# EAGLE design PS2Encoder (generic) (EAGLE 5.03)
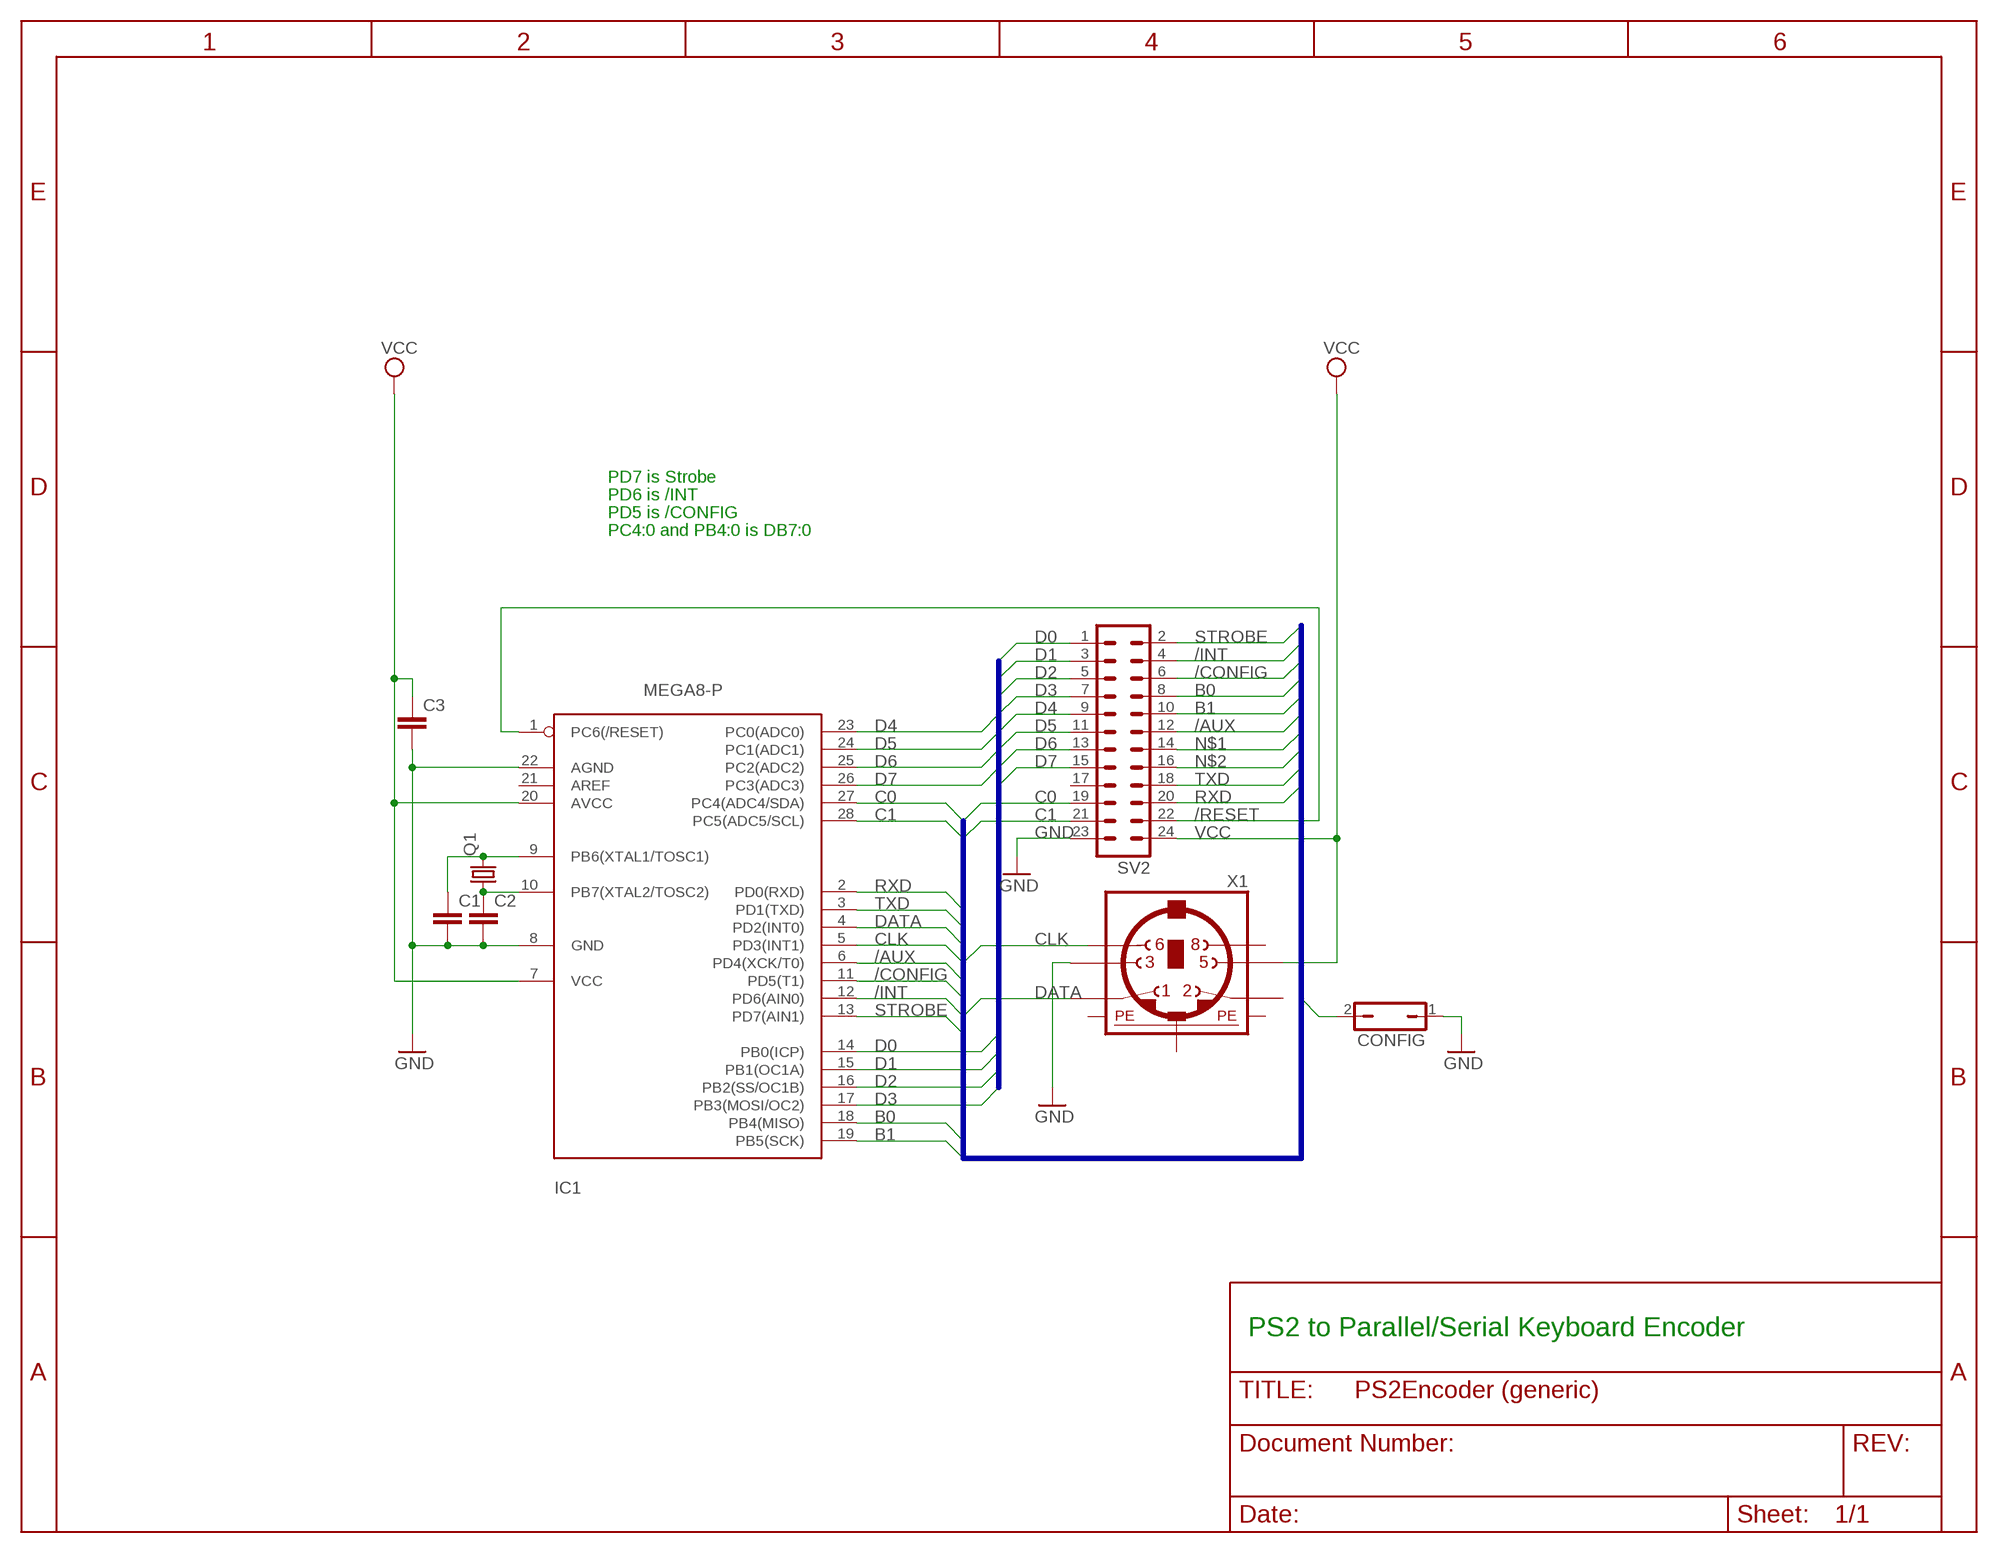
[diagram p0: schematic, sheet 1]

## Parts
C1  C-EU025-024X044  [C025-024X044]
C2  C-EU025-024X044  [C025-024X044]
C3  C-EU025-024X044  [C025-024X044]
CONFIG  JP1Q  [JP1]
IC1  MEGA8-P  [DIL28-3]
Q1  CRYSTALHC49U-V  [HC49U-V]
SV2  MA12-2  [MA12-2]
X1  MINI_DIN_6  [M_DIN6]

## Nets
/AUX: IC1.6(PD4(XCK/T0)) SV2.12
/CONFIG: CONFIG.2 IC1.11(PD5(T1)) SV2.6
/INT: IC1.12(PD6(AIN0)) SV2.4
/RESET: IC1.1(PC6(/RESET)) SV2.22
B0: IC1.18(PB4(MISO)) SV2.8
B1: IC1.19(PB5(SCK)) SV2.10
C0: IC1.27(PC4(ADC4/SDA)) SV2.19
C1: IC1.28(PC5(ADC5/SCL)) SV2.21
CLK: IC1.5(PD3(INT1)) X1.6
D0: IC1.14(PB0(ICP)) SV2.1
D1: IC1.15(PB1(OC1A)) SV2.3
D2: IC1.16(PB2(SS/OC1B)) SV2.5
D3: IC1.17(PB3(MOSI/OC2)) SV2.7
D4: IC1.23(PC0(ADC0)) SV2.9
D5: IC1.24(PC1(ADC1)) SV2.11
D6: IC1.25(PC2(ADC2)) SV2.13
D7: IC1.26(PC3(ADC3)) SV2.15
DATA: IC1.4(PD2(INT0)) X1.1
GND: C1.2 C2.2 C3.2 CONFIG.1 IC1.8(GND) IC1.22(AGND) SV2.23 X1.3
N$1: SV2.14
N$2: SV2.16
N$4: C2.1 IC1.10(PB7(XTAL2/TOSC2)) Q1.1
N$5: C1.1 IC1.9(PB6(XTAL1/TOSC1)) Q1.2
RXD: IC1.2(PD0(RXD)) SV2.20
STROBE: IC1.13(PD7(AIN1)) SV2.2
TXD: IC1.3(PD1(TXD)) SV2.18
VCC: C3.1 IC1.7(VCC) IC1.20(AVCC) SV2.24 X1.5
Unconnected: IC1.21(AREF) SV2.17 X1.2 X1.8

## Buses
D[0..7]
RXD,TXD,/CONFIG,STROBE,/INT,B0,B1,C0,C1,CLK,DATA,/AUX

## Notes on the sheet
- PD7 is Strobe
- PD6 is /INT
- PD5 is /CONFIG
- PC4:0 and PB4:0 is DB7:0
- PS2 to Parallel/Serial Keyboard Encoder

## Power pins joined to a net without a drawn wire
PE1: X1.SH1(PE1)
PE2: X1.SH2(PE2)
PE3: X1.SH3(PE3)

## Library data of the parts
C1-C3 = rcl:C-EU: CAPACITOR, European symbol
CONFIG = jumper:JP1Q: JUMPER
IC1 = atmel:MEGA8-P: MICROCONTROLLER 8 Kbytes FLASH 1 kbytes SRAM 512 bytes EEPROM USART 4-channel 10 bit ADC 2-channel 8 bit ADC Source: avr.lbr
Q1 = crystal:CRYSTAL: CRYSTAL
SV2 = con-lstb:MA12-2: PIN HEADER
X1 = mini_din:MINI_DIN_6

## Board
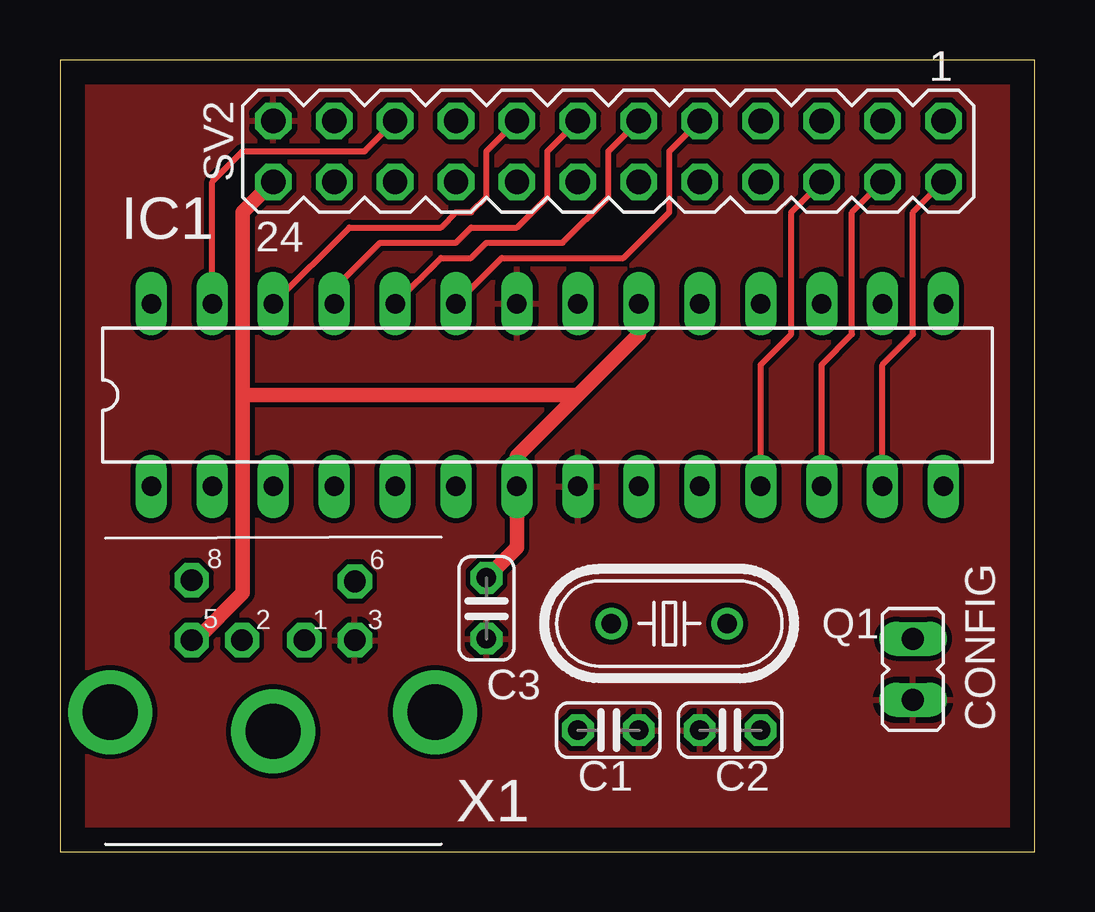
[diagram p1: board, top side]
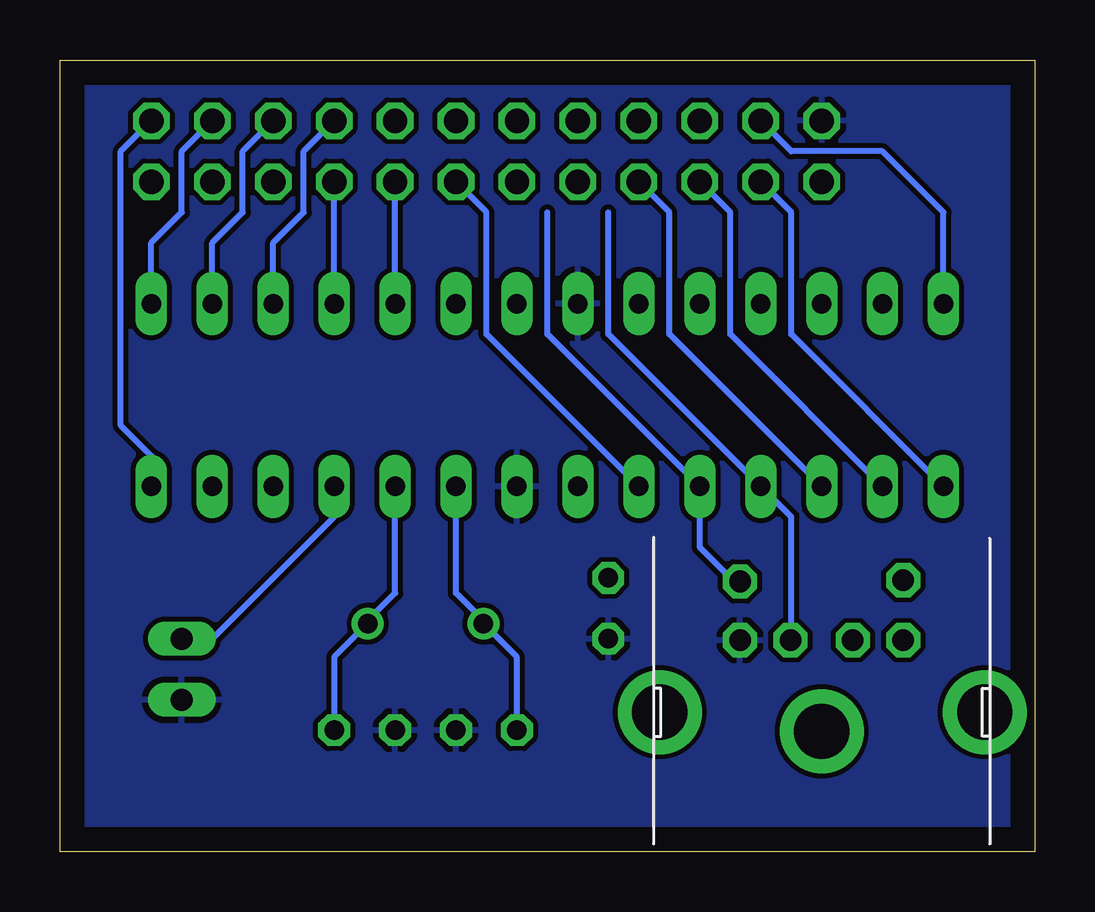
[diagram p2: board, bottom side, seen from below]

Size 40.64 x 33.02 mm. Coordinates in mm from the lower left corner, seen from the top.
Outline: 40.64,0 40.64,33.02 0,33.02 0,0 40.64,0
Copper layers (1*16): Top 0.035mm / dielectric 1.5mm / Bottom 0.035mm
Design rules "default": minimum track width 10mil, minimum drill 24mil, track to track 8mil, track to pad 8mil, pad to pad 8mil, via to via 8mil, smd to smd 8mil, copper to edge 40mil, drill to drill 8mil, minimum pad ring 10mil, minimum via ring 8mil, stop-mask expansion 4mil, vias tented up to drill 0mil, thermal gap 10mil

### Footprints (pad centres in the part's own frame; a part is rotated, then mirrored left to right if it is on the bottom)
C025-024X044 = drill 0.813 octagon: 1 -1.27,0; 2 1.27,0
JP1 = drill 0.914 long: 1 0,-1.27; 2 0,1.27
DIL28-3 = drill 0.813 long: 1 -16.51,-3.81; 2 -13.97,-3.81; 3 -11.43,-3.81; 4 -8.89,-3.81; 5 -6.35,-3.81; 6 -3.81,-3.81; 7 -1.27,-3.81; 8 1.27,-3.81; 9 3.81,-3.81; 10 6.35,-3.81; 11 8.89,-3.81; 12 11.43,-3.81; 13 13.97,-3.81; 14 16.51,-3.81; 15 16.51,3.81; 16 13.97,3.81; 17 11.43,3.81; 18 8.89,3.81; 19 6.35,3.81; 20 3.81,3.81; 21 1.27,3.81; 22 -1.27,3.81; 23 -3.81,3.81; 24 -6.35,3.81; 25 -8.89,3.81; 26 -11.43,3.81; 27 -13.97,3.81; 28 -16.51,3.81
HC49U-V = drill 0.813 round: 1 -2.413,0; 2 2.413,0
MA12-2 = drill 1.016 octagon: 1 -13.97,-1.27; 2 -13.97,1.27; 3 -11.43,-1.27; 4 -11.43,1.27; 5 -8.89,-1.27; 6 -8.89,1.27; 7 -6.35,-1.27; 8 -6.35,1.27; 9 -3.81,-1.27; 10 -3.81,1.27; 11 -1.27,-1.27; 12 -1.27,1.27; 13 1.27,-1.27; 14 1.27,1.27; 15 3.81,-1.27; 16 3.81,1.27; 17 6.35,-1.27; 18 6.35,1.27; 19 8.89,-1.27; 20 8.89,1.27; 21 11.43,-1.27; 22 11.43,1.27; 23 13.97,-1.27; 24 13.97,1.27
M_DIN6 = drill 0.9 pad 1.422 octagon: 1 -1.3,-3.75; 2 1.3,-3.75; 3 -3.4,-3.75; 5 3.4,-3.75; 6 -3.4,-6.2; 8 3.4,-6.25 | drill 2.3 pad 3.5 round: SH1 6.8,-0.75; SH2 0,0.05; SH3 -6.75,-0.75

### Placement (x,y rotation side)
C1  22.86,5.08 0 top
C2  27.94,5.08 180 top
C3  17.78,10.16 270 top
CONFIG  35.56,7.62 0 top
IC1  20.32,19.05 0 top
Q1  25.4,9.53 180 top
SV2  22.86,29.21 180 top
X1  8.89,5.08 180 top

### Tracks (layer width: path | path; a pad name or v marks a point on that pad's centre or on a via)
/AUX
  Bottom 0.254: IC1.6 22.86,21.59 22.86,26.67 SV2.12
/CONFIG
  Top 0.254: IC1.11 29.21,20.32 30.48,21.59 30.48,26.67 SV2.6
  Bottom 0.254: IC1.11 29.21,13.97 34.29,8.89 CONFIG.2
/INT
  Top 0.254: IC1.12 31.75,20.32 33.02,21.59 33.02,26.67 SV2.4
/RESET
  Bottom 0.254: IC1.1 10.16,21.59 10.16,26.67 SV2.22
B0
  Bottom 0.254: IC1.18 SV2.8
B1
  Bottom 0.254: IC1.19 SV2.10
C0
  Top 0.254: IC1.27 6.35,27.94 7.62,29.21 12.7,29.21 SV2.19
C1
  Bottom 0.254: IC1.28 3.81,26.67 6.35,29.21 10.16,29.21 SV2.21
CLK
  Bottom 0.254: 20.32,26.67 20.32,21.59 IC1.5 13.97,12.7 12.55,11.28 X1.6
D0
  Bottom 0.254: IC1.14 36.83,16.51 38.1,17.78 38.1,29.21 SV2.1
D1
  Bottom 0.254: IC1.15 36.83,25.4 35.56,26.67 35.56,29.21 SV2.3
D2
  Bottom 0.254: IC1.16 34.29,25.4 33.02,26.67 33.02,29.21 SV2.5
D3
  Bottom 0.254: IC1.17 31.75,25.4 30.48,26.67 30.48,29.21 SV2.7
D4
  Top 0.254: SV2.9 25.4,29.21 25.4,26.67 23.5,24.77 18.41,24.77 IC1.23
D5
  Top 0.254: IC1.24 15.88,24.77 17.14,24.77 17.78,25.4 20.95,25.4 22.86,27.3 22.86,29.21 SV2.11
D6
  Top 0.254: IC1.25 11.43,23.5 13.34,25.4 16.51,25.4 17.14,26.04 19.05,26.04 20.32,27.3 20.32,29.21 SV2.13
D7
  Top 0.254: IC1.26 12.06,26.04 15.88,26.04 16.51,26.67 17.14,26.67 17.78,27.3 17.78,29.21 SV2.15
DATA
  Bottom 0.254: 17.78,26.67 17.78,21.59 IC1.4 10.16,13.97 10.16,8.89 10.19,8.86 X1.1
GND
  pour Bottom: 0,0 40.64,0 40.64,33.02 0,33.02
  pour Top: 0,0 40.64,0 40.64,33.02 0,33.02
N$4
  Bottom 0.254: IC1.10 26.67,10.79 27.94,9.53 Q1.1 29.21,8.13 C2.1
N$5
  Bottom 0.254: IC1.9 24.13,10.79 22.86,9.53 Q1.2 21.59,8.13 C1.1
RXD
  Bottom 0.254: IC1.2 12.7,21.59 12.7,26.67 SV2.20
STROBE
  Top 0.254: IC1.13 34.29,20.32 35.56,21.59 35.56,26.67 SV2.2
TXD
  Bottom 0.254: IC1.3 15.24,21.59 15.24,26.67 SV2.18
VCC
  Top 0.61: SV2.24 7.62,26.67 7.62,19.05 | X1.5 5.66,8.83 7.62,10.79 7.62,19.05 | IC1.20 24.13,21.59 21.59,19.05 | 21.59,19.05 19.05,16.51 IC1.7 19.05,12.7 C3.1 | 7.62,19.05 21.59,19.05